# Altium project LPC55S69_Board.PrjPcb (part 1 of 2)
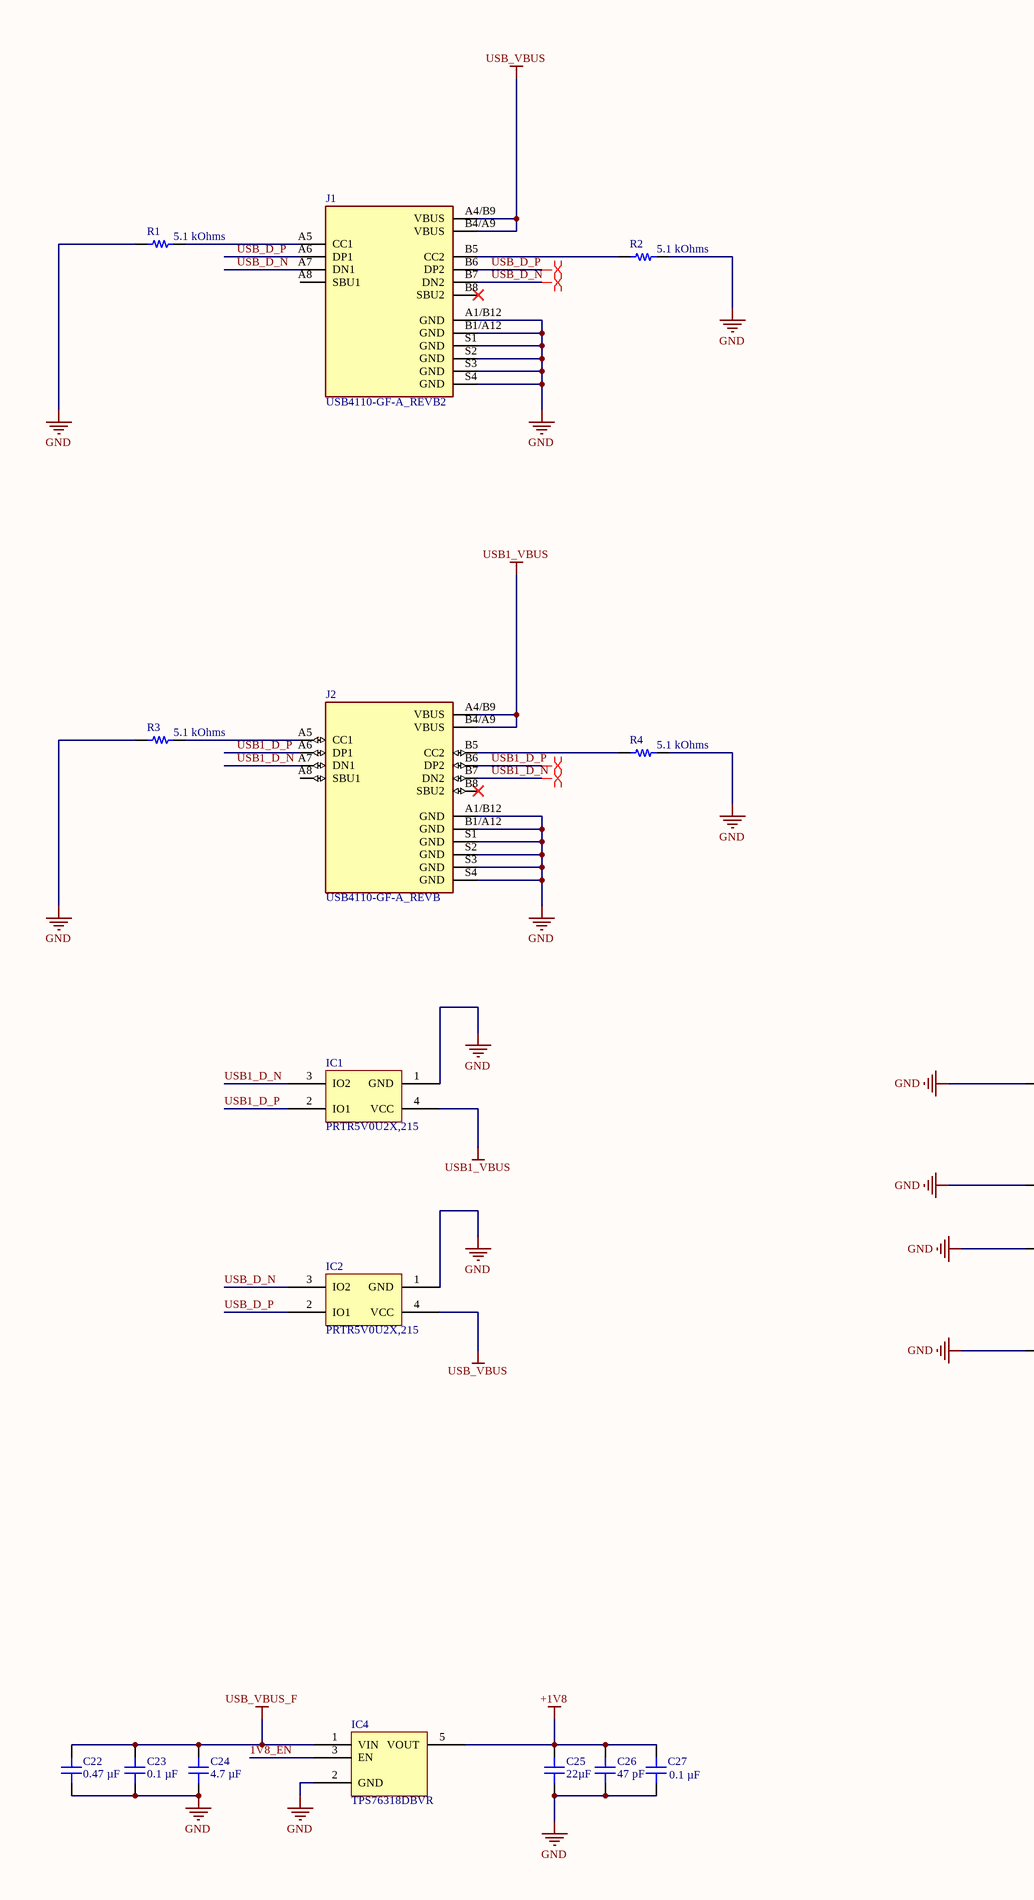
[diagram p0: Main.SchDoc, left]
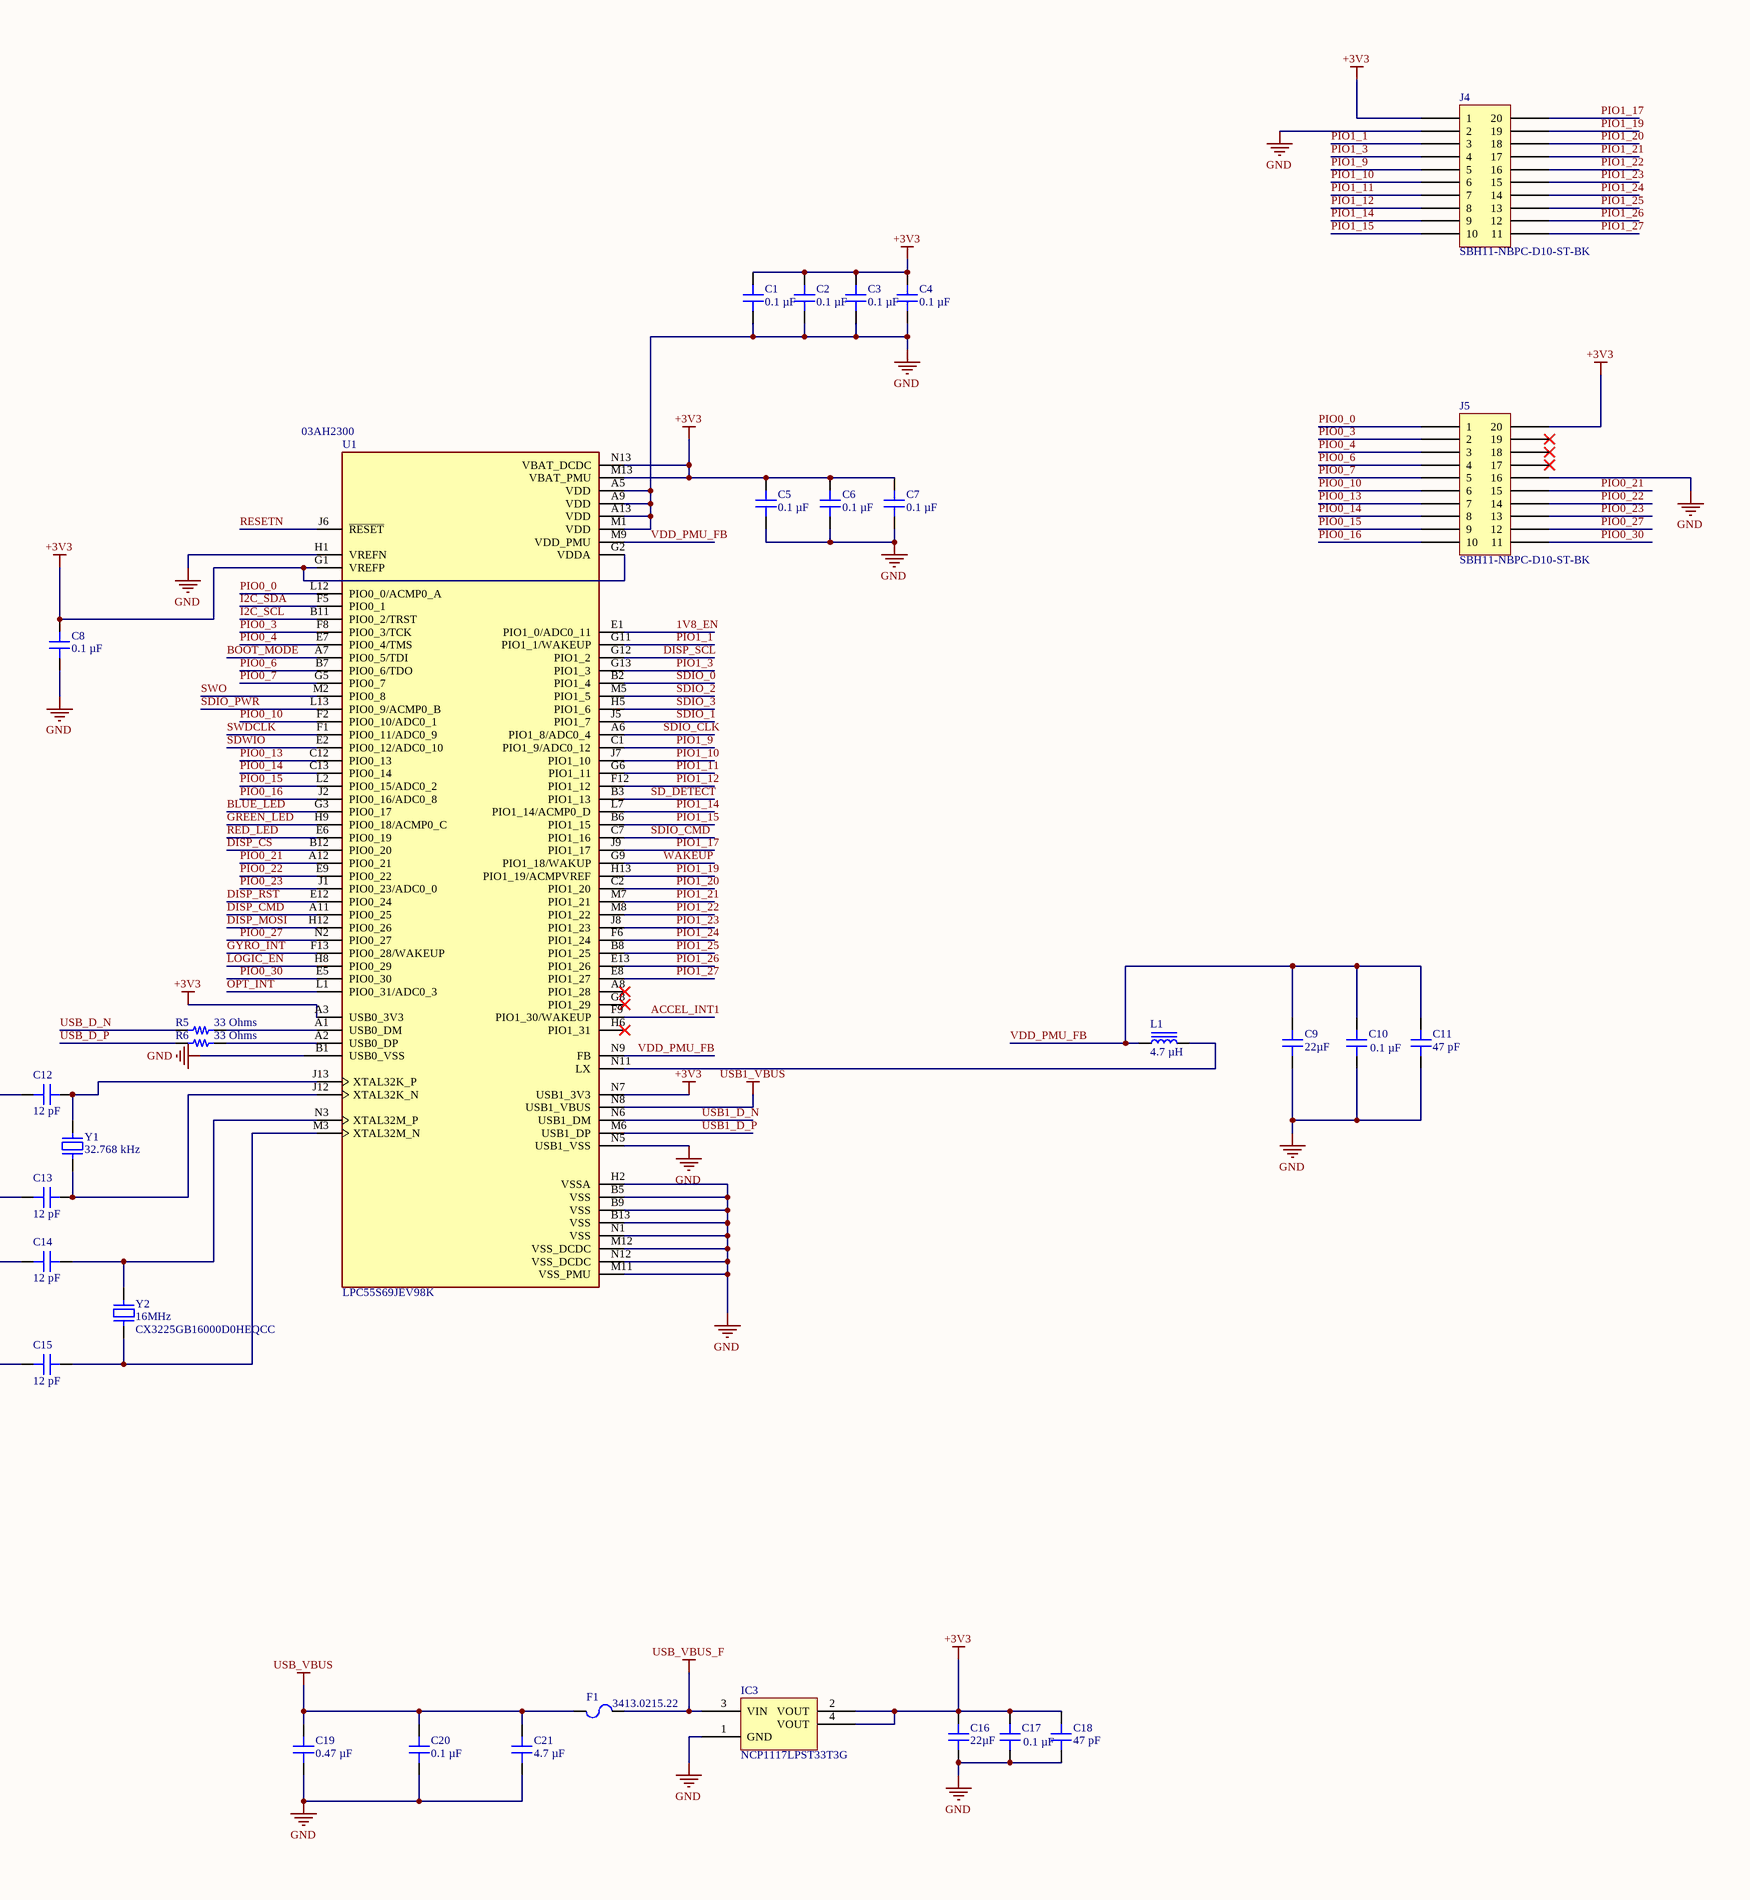
[diagram p1: Main.SchDoc, right]
3 sheets, 143 parts. Net scope: global (net labels, ports and power ports of the same name join across sheets).
Board file: LPC_DevBoard.PcbDoc
Sheets:
  Main.SchDoc
  Sensors.SchDoc
  microSD_Display.SchDoc

## Sheet Main.SchDoc
size A2; SheetNumber: 1; SheetTotal: 3

### Parts
C1  0.1 µF  [CAP 0603_1608]
C2  0.1 µF  [CAP 0603_1608]
C3  0.1 µF  [CAP 0603_1608]
C4  0.1 µF  [CAP 0603_1608]
C5  0.1 µF  [CAP 0603_1608]
C6  0.1 µF  [CAP 0603_1608]
C7  0.1 µF  [CAP 0603_1608]
C8  0.1 µF  [CAP 0603_1608]
C9  22µF  [CAP 0603_1608]
C10  0.1 µF  [CAP 0603_1608]
C11  47 pF  [CAP 0603_1608]
C12  12 pF  [CAP 0603_1608]
C13  12 pF  [CAP 0603_1608]
C14  12 pF  [CAP 0603_1608]
C15  12 pF  [CAP 0603_1608]
C16  22µF  [CAP 0603_1608]
C17  0.1 µF  [CAP 0603_1608]
C18  47 pF  [CAP 0603_1608]
C19  0.47 µF  [CAP 0603_1608]
C20  0.1 µF  [CAP 0603_1608]
C21  4.7 µF  [CAP 0603_1608]
C22  0.47 µF  [CAP 0603_1608]
C23  0.1 µF  [CAP 0603_1608]
C24  4.7 µF  [CAP 0603_1608]
C25  22µF  [CAP 0603_1608]
C26  47 pF  [CAP 0603_1608]
C27  0.1 µF  [CAP 0603_1608]
F1  3413.0215.22  [FUSE 1206_3216 0.6MM]
IC1  PRTR5V0U2X,215  [SOT143B]
IC2  PRTR5V0U2X,215  [SOT143B]
IC3  NCP1117LPST33T3G  [ON SEMI SOT-223 ST(318H)]
IC4  TPS76318DBVR  [TI SOT-23-5 DBV]
J1  USB4110-GF-A_REVB2  [USBNew]
J2  USB4110-GF-A_REVB  [GCT_USB4110-GF-A_REVB]
J4  SBH11-NBPC-D10-ST-BK  [SULLINS SBH11-NBPC-D10-ST-BK]
J5  SBH11-NBPC-D10-ST-BK  [SULLINS SBH11-NBPC-D10-ST-BK]
L1  4.7 µH  [TDK VLS252012CX]
R1  5.1 kOhms  [RES 0603_1608]
R2  5.1 kOhms  [RES 0603_1608]
R3  5.1 kOhms  [RES 0603_1608]
R4  5.1 kOhms  [RES 0603_1608]
R5  33 Ohms  [RES 0603_1608]
R6  33 Ohms  [RES 0603_1608]
U1  LPC55S69JEV98K  Supplier Part Number 1: 03AH2300  [IC_LPC55S69JEV98K]
Y1  32.768 kHz  [ABRACON ABS06]
Y2  16MHz  Part Number: CX3225GB16000D0HEQCC  [KYOCERA CX3225GB]

### Nets
+1V8: C25.1 C26.2 C27.2 IC4.5(VOUT)
+3V3: C1.2 C2.2 C3.2 C4.2 C5.2 C6.2 C7.2 C8.2 C16.1 C17.2 C18.2 IC3.2(VOUT) IC3.4(VOUT) J4.1 J5.20 U1.A3(USB0_3V3) U1.G1(VREFP) U1.G2(VDDA) U1.M13(VBAT_PMU) U1.N7(USB1_3V3) U1.N13(VBAT_DCDC)
GND: C1.1 C2.1 C3.1 C4.1 C5.1 C6.1 C7.1 C8.1 C9.2 C10.1 C11.1 C12.2 C13.2 C14.2 C15.2 C16.2 C17.1 C18.1 C19.1 C20.1 C21.1 C22.1 C23.1 C24.1 C25.2 C26.1 C27.1 IC1.1(GND) IC2.1(GND) IC3.1(GND) IC4.2(GND) J1.A1/B12(GND) J1.B1/A12(GND) J1.S1(GND) J1.S2(GND) J1.S3(GND) J1.S4(GND) J2.A1/B12(GND) J2.B1/A12(GND) J2.S1(GND) J2.S2(GND) J2.S3(GND) J2.S4(GND) J4.2 J5.16 R1.1 R2.2 R3.1 R4.2 U1.A5(VDD) U1.A9(VDD) U1.A13(VDD) U1.B1(USB0_VSS) U1.B5(VSS) U1.B9(VSS) U1.B13(VSS) U1.H1(VREFN) U1.H2(VSSA) U1.M1(VDD) U1.M11(VSS_PMU) U1.M12(VSS_DCDC) U1.N1(VSS) U1.N5(USB1_VSS) U1.N12(VSS_DCDC)
USB1_VBUS: IC1.4(VCC) J2.A4/B9(VBUS) J2.B4/A9(VBUS) U1.N8(USB1_VBUS)
USB_VBUS: C19.2 C20.2 C21.2 F1.1 IC2.4(VCC) J1.A4/B9(VBUS) J1.B4/A9(VBUS)
USB_VBUS_F: C22.2 C23.2 C24.2 F1.2 IC3.3(VIN) IC4.1(VIN)
1V8_EN: IC4.3(EN) U1.E1(PIO1_0/ADC0_11)
ACCEL_INT1: U1.F9(PIO1_30/WAKEUP)
BLUE_LED: U1.G3(PIO0_17)
BOOT_MODE: U1.A7(PIO0_5/TDI)
DISP_CMD: U1.A11(PIO0_25)
DISP_CS: U1.B12(PIO0_20)
DISP_MOSI: U1.H12(PIO0_26)
DISP_RST: U1.E12(PIO0_24)
DISP_SCL: U1.G12(PIO1_2)
GREEN_LED: U1.H9(PIO0_18/ACMP0_C)
GYRO_INT: U1.F13(PIO0_28/WAKEUP)
I2C_SCL: U1.B11(PIO0_2/TRST)
I2C_SDA: U1.F5(PIO0_1)
LOGIC_EN: U1.H8(PIO0_29)
OPT_INT: U1.L1(PIO0_31/ADC0_3)
PIO0_0: J5.1 U1.L12(PIO0_0/ACMP0_A)
PIO0_3: J5.2 U1.F8(PIO0_3/TCK)
PIO0_4: J5.3 U1.E7(PIO0_4/TMS)
PIO0_6: J5.4 U1.B7(PIO0_6/TDO)
PIO0_7: J5.5 U1.G5(PIO0_7)
PIO0_10: J5.6 U1.F2(PIO0_10/ADC0_1)
PIO0_13: J5.7 U1.C12(PIO0_13)
PIO0_14: J5.8 U1.C13(PIO0_14)
PIO0_15: J5.9 U1.L2(PIO0_15/ADC0_2)
PIO0_16: J5.10 U1.J2(PIO0_16/ADC0_8)
PIO0_21: J5.15 U1.A12(PIO0_21)
PIO0_22: J5.14 U1.E9(PIO0_22)
PIO0_23: J5.13 U1.J1(PIO0_23/ADC0_0)
PIO0_27: J5.12 U1.N2(PIO0_27)
PIO0_30: J5.11 U1.E5(PIO0_30)
PIO1_1: J4.3 U1.G11(PIO1_1/WAKEUP)
PIO1_3: J4.4 U1.G13(PIO1_3)
PIO1_9: J4.5 U1.C1(PIO1_9/ADC0_12)
PIO1_10: J4.6 U1.J7(PIO1_10)
PIO1_11: J4.7 U1.G6(PIO1_11)
PIO1_12: J4.8 U1.F12(PIO1_12)
PIO1_14: J4.9 U1.L7(PIO1_14/ACMP0_D)
PIO1_15: J4.10 U1.B6(PIO1_15)
PIO1_17: J4.20 U1.J9(PIO1_17)
PIO1_19: J4.19 U1.H13(PIO1_19/ACMPVREF)
PIO1_20: J4.18 U1.C2(PIO1_20)
PIO1_21: J4.17 U1.M7(PIO1_21)
PIO1_22: J4.16 U1.M8(PIO1_22)
PIO1_23: J4.15 U1.J8(PIO1_23)
PIO1_24: J4.14 U1.F6(PIO1_24)
PIO1_25: J4.13 U1.B8(PIO1_25)
PIO1_26: J4.12 U1.E13(PIO1_26)
PIO1_27: J4.11 U1.E8(PIO1_27)
RED_LED: U1.E6(PIO0_19)
RESETN: U1.J6(~{RESET})
SD_DETECT: U1.B3(PIO1_13)
SDIO_0: U1.B2(PIO1_4)
SDIO_1: U1.J5(PIO1_7)
SDIO_2: U1.M5(PIO1_5)
SDIO_3: U1.H5(PIO1_6)
SDIO_CLK: U1.A6(PIO1_8/ADC0_4)
SDIO_CMD: U1.C7(PIO1_16)
SDIO_PWR: U1.L13(PIO0_9/ACMP0_B)
SDWIO: U1.E2(PIO0_12/ADC0_10)
SWDCLK: U1.F1(PIO0_11/ADC0_9)
SWO: U1.M2(PIO0_8)
USB1_D_N: IC1.3(IO2) J2.A7(DN1) J2.B7(DN2) U1.N6(USB1_DM)
USB1_D_P: IC1.2(IO1) J2.A6(DP1) J2.B6(DP2) U1.M6(USB1_DP)
USB_D_N: IC2.3(IO2) J1.A7(DN1) J1.B7(DN2) R5.1
USB_D_P: IC2.2(IO1) J1.A6(DP1) J1.B6(DP2) R6.1
VDD_PMU_FB: C9.1 C10.2 C11.2 L1.1 U1.M9(VDD_PMU) U1.N9(FB)
WAKEUP: U1.G9(PIO1_18/WAKUP)
NetC12_1: C12.1 U1.J13(XTAL32K_P) Y1.2
NetC13_1: C13.1 U1.J12(XTAL32K_N) Y1.1
NetC14_1: C14.1 U1.N3(XTAL32M_P) Y2.1
NetC15_1: C15.1 U1.M3(XTAL32M_N) Y2.3
NetJ1_A5: J1.A5(CC1) R1.2
NetJ1_B5: J1.B5(CC2) R2.1
NetJ2_A5: J2.A5(CC1) R3.2
NetJ2_B5: J2.B5(CC2) R4.1
NetL1_2: L1.2 U1.N11(LX)
NetR5_2: R5.2 U1.A1(USB0_DM)
NetR6_2: R6.2 U1.A2(USB0_DP)

Not connected (* = marked no-connect by the designer): J1 A8(SBU1) B8(SBU2)*; J2 A8(SBU1) B8(SBU2)*; J5 17* 18* 19*; U1 A8(PIO1_28)* G8(PIO1_29)* H6(PIO1_31)*

### Layout directives
differential pair: USB1_D_N, USB1_D_P, USB_D_N, USB_D_P

### Library data of the parts
C1-C8 C10 C17 C20 C23 C27 = CS0603KRX7R7BB104: CAP CER 0.1UF 16V X7R 0603; manufacturer: Yageo; Tolerance: ±10%; Part Number: CS0603KRX7R7BB104; Value: 0.1 µF; Applications: Boardflex Sensitive; Capacitance: 0.1 µF; componentlink1description: Datasheet; componentlink1url: http://www.yageo.com/NewPortal/yageodocoutput?fileName=/pdf/MLCC/UPY-ST_NPOX7R_16V-to-3KV_5.pdf; componentlink2description: DigiKey Link; componentlink2url: https://www.digikey.com/en/products/detail/yageo/CS0603KRX7R7BB104/6097897; Device Package: 0603 (1608 Metric); Features: Soft Termination; lastupdated: 12.06.2022 00:52:33; Lifecycle Status: Active; Minimum Order: 1; Mounting Type: Surface Mount, MLCC; Operating Temperature: -55°C ~ 125°C; Package / Case: 0603 (1608 Metric); packaging: TapeAndReel; partid: 2286; Part Status: Active; price: 0.02; series: CS; Size / Dimension: 0.063" L x 0.031" W (1.60mm x 0.80mm); Supplier 1: DigiKey; Supplier Part Number 1: 311-3560-1-ND; Temperature Coefficient: X7R; Thickness (Max): 0.037" (0.95mm); Voltage - Rated: 16V
C9 C16 C25 = 06036D226MAT2A: CAP CER 22UF 6.3V X5R 0603; manufacturer: AVX Corporation; Tolerance: ±20%; Part Number: 06036D226MAT2A; Value: 22µF; Applications: General Purpose; Capacitance: 22µF; componentlink1description: Datasheet; componentlink1url: http://datasheets.avx.com/cx5r.pdf; componentlink2description: DigiKey Link; componentlink2url: http://digikey.com/product-detail/en/avx-corporation/06036D226MAT2A/478-10812-1-ND/7536349; Device Package: 0603 (1608 Metric); lastupdated: 2.09.2020 01:03:16; Lifecycle Status: Active; Minimum Order: 1; Mounting Type: Surface Mount, MLCC; Operating Temperature: -55°C ~ 85°C; Package / Case: 0603 (1608 Metric); packaging: TapeAndReel; partid: 13180; Part Status: Active; price: 0.10; series: -; Size / Dimension: 0.063" L x 0.032" W (1.60mm x 0.81mm); Supplier 1: DigiKey; Supplier Part Number 1: 478-10812-1-ND; Temperature Coefficient: X5R; Thickness (Max): 0.040" (1.02mm); Voltage - Rated: 6.3V
C11 C18 C26 = C0603C470J3GACAUTO: CAP CER 47PF 25V C0G/NP0 0603; manufacturer: KEMET; Temperature Coefficient: C0G, NP0; Tolerance: ±5%; Part Number: C0603C470J3GACAUTO; Value: 47 pF; Applications: Automotive; Capacitance: 47 pF; componentlink1description: Datasheet; componentlink1url: https://api.kemet.com/component-edge/download/datasheet/C0603C470J3GACAUTO.pdf; componentlink2description: DigiKey Link; componentlink2url: https://www.digikey.com/en/products/detail/kemet/C0603C470J3GACAUTO/3314884; Device Package: 0603 (1608 Metric); Features: Low ESL; lastupdated: 12.06.2022 00:51:55; Lifecycle Status: Active; Minimum Order: 1; Mounting Type: Surface Mount, MLCC; Operating Temperature: -55°C ~ 125°C; Package / Case: 0603 (1608 Metric); packaging: TapeAndReel; partid: 15056; Part Status: Active; price: 0.02; Ratings: AEC-Q200; series: SMD Auto C0G; Size / Dimension: 0.063" L x 0.031" W (1.60mm x 0.80mm); Supplier 1: DigiKey; Supplier Part Number 1: 399-6889-1-ND; Thickness (Max): 0.034" (0.87mm); Voltage - Rated: 25V
C12-C15 = CC0603GRNPO9BN120: CAP CER 12PF 50V C0G/NPO 0603; manufacturer: Yageo; Temperature Coefficient: C0G, NP0; Tolerance: ±2%; Part Number: CC0603GRNPO9BN120; Value: 12 pF; Applications: General Purpose; Capacitance: 12 pF; componentlink1description: Datasheet; componentlink1url: https://www.yageo.com/upload/media/product/productsearch/datasheet/mlcc/UPY-GP_NP0_16V-to-50V_17.pdf; componentlink2description: DigiKey Link; componentlink2url: https://www.digikey.com/en/products/detail/yageo/CC0603GRNPO9BN120/5883540; Device Package: 0603 (1608 Metric); lastupdated: 14.06.2022 20:58:18; Lifecycle Status: Active; Minimum Order: 1; Mounting Type: Surface Mount, MLCC; Operating Temperature: -55°C ~ 125°C; Package / Case: 0603 (1608 Metric); packaging: TapeAndReel; partid: 3692; Part Status: Active; price: 0.02; series: CC; Size / Dimension: 0.063" L x 0.031" W (1.60mm x 0.80mm); Supplier 1: DigiKey; Supplier Part Number 1: 311-3917-1-ND; Thickness (Max): 0.035" (0.90mm); Voltage - Rated: 50V
C19 C22 = CC0603KRX5R6BB474: CAP CER 0.47UF 10V X5R 0603; manufacturer: Yageo; Tolerance: ±10%; Part Number: CC0603KRX5R6BB474; Value: 0.47 µF; Applications: General Purpose; Capacitance: 0.47 µF; componentlink1description: Datasheet; componentlink1url: https://www.yageo.com/upload/media/product/productsearch/datasheet/mlcc/UPY-GPHC_X5R_4V-to-50V_25.pdf; componentlink2description: DigiKey Link; componentlink2url: https://www.digikey.com/en/products/detail/yageo/CC0603KRX5R6BB474/2345079; Device Package: 0603 (1608 Metric); lastupdated: 12.06.2022 00:52:33; Lifecycle Status: Active; Minimum Order: 1; Mounting Type: Surface Mount, MLCC; Operating Temperature: -55°C ~ 85°C; Package / Case: 0603 (1608 Metric); packaging: TapeAndReel; partid: 2283; Part Status: Active; price: 0.02; series: CC; Size / Dimension: 0.063" L x 0.031" W (1.60mm x 0.80mm); Supplier 1: DigiKey; Supplier Part Number 1: 311-1783-1-ND; Temperature Coefficient: X5R; Thickness (Max): 0.035" (0.90mm); Voltage - Rated: 10V
C21 C24 = GRM188C71A475KE11D: CAP CER 4.7UF 10V X7S 0603; manufacturer: Murata Electronics; Tolerance: ±10%; Part Number: GRM188C71A475KE11D; Value: 4.7 µF; Applications: General Purpose; Capacitance: 4.7 µF; componentlink1description: Datasheet; componentlink1url: https://search.murata.co.jp/Ceramy/image/img/A01X/G101/ENG/GRM188C71A475KE11-01.pdf; componentlink2description: DigiKey Link; componentlink2url: https://www.digikey.com/en/products/detail/murata-electronics/GRM188C71A475KE11D/4905309; Device Package: 0603 (1608 Metric); lastupdated: 12.06.2022 00:52:33; Lifecycle Status: Active; Minimum Order: 1; Mounting Type: Surface Mount, MLCC; Operating Temperature: -55°C ~ 125°C; Package / Case: 0603 (1608 Metric); packaging: TapeAndReel; partid: 2397; Part Status: Active; price: 0.05; series: GRM; Size / Dimension: 0.063" L x 0.031" W (1.60mm x 0.80mm); Supplier 1: DigiKey; Supplier Part Number 1: 490-11992-1-ND; Temperature Coefficient: X7S; Thickness (Max): 0.037" (0.95mm); Voltage - Rated: 10V
F1 = 3413.0215.22: FUSE BOARD MNT 800MA 32VAC 63VDC; Manufacturer: Schurter Inc.; Approval Agency: cURus, VDE; Breaking Capacity @ Rated Voltage: 63A; Fuse Type: Board Mount (Cartridge Style Excluded); Melting I²t: 0.18; Response Time: Fast Blow; Voltage Rating - AC: 32V; Voltage Rating - DC: 63V; Part Number: 3413.0215.22; Approvals: cURus, VDE; ComponentLink1Description: Datasheet; ComponentLink1URL: https://us.schurter.com/pdf/english/typ_USI_1206.pdf; ComponentLink2Description: DigiKey Link; ComponentLink2URL: http://digikey.com/product-detail/en/schurter-inc/3413.0215.22/486-1143-1-ND/1522975; Current Rating (Amps): 800mA; Device Package: 1206 (3216 Metric); LastUpdated: 2.09.2020 01:30:41; Lifecycle Status: Active; Minimum Order: 1; Mounting Type: Surface Mount; Operating Temperature: -55°C ~ 90°C; Package / Case: 1206 (3216 Metric); Packaging: TapeAndReel; Part Status: Active; Price: 0.26; Series: USI 1206; Size / Dimension: 0.126" L x 0.063" W x 0.024" H (3.20mm x 1.60mm x 0.60mm); Supplier 1: DigiKey; Supplier Part Number 1: 486-1143-1-ND
IC1 IC2 = PRTR5V0U2X,215: TVS DIODE 5.5V SOT143B; Manufacturer: Nexperia USA Inc.; Capacitance @ Frequency: 1pF @ 1MHz; Power Line Protection: Yes; Unidirectional Channels: 2; Voltage - Breakdown (Min): 6V; Voltage - Reverse Standoff (Typ): 5.5V (Max); Part Number: PRTR5V0U2X,215; Applications: General Purpose; ComponentLink1Description: Datasheet; ComponentLink1URL: https://assets.nexperia.com/documents/data-sheet/PRTR5V0U2X.pdf; ComponentLink2Description: DigiKey Link; ComponentLink2URL: //digikey.com/product-detail/en/nexperia-usa-inc/PRTR5V0U2X215/1727-3884-2-ND/1163690; Device Package: TO-253-4, TO-253AA; LastUpdated: 9.12.2019 21:29:05; Lifecycle Status: 0; Minimum Order: 1; Mounting Type: Surface Mount; Operating Temperature: -40°C ~ 85°C (TA); Package / Case: TO-253-4, TO-253AA; Packaging: TapeAndReel; PartId: 5451; Part Status: Active; Price: 0.18; Series: -; Supplier 1: DigiKey; Supplier Part Number 1: 1727-3884-2-ND; Supplier Device Package: SOT-143B; Type: Steering (Rail to Rail)
IC3 = NCP1117LPST33T3G: IC REG LINEAR 3.3V 1A SOT223; Manufacturer: ON Semiconductor; Current - Quiescent (Iq): 700µA; Number of Regulators: 1; Output Configuration: Positive; Output Type: Fixed; Protection Features: Over Current, Over Temperature; PSRR: 60dB (120Hz); Voltage Dropout (Max): 1.4V @ 1A; Voltage - Input (Max): 18V; Part Number: NCP1117LPST33T3G; ComponentLink1Description: Datasheet; ComponentLink1URL: http://www.onsemi.com/pub/Collateral/NCP1117LP-D.PDF; ComponentLink2Description: DigiKey Link; ComponentLink2URL: http://digikey.com/product-detail/en/on-semiconductor/NCP1117LPST33T3G/NCP1117LPST33T3GOSCT-ND/3462387; Current - Output: 1A; LastUpdated: 12.06.2022 01:44:12; Lifecycle Status: Active; Minimum Order: 1; Mounting Type: Surface Mount; Package / Case: TO-261-4, TO-261AA; Packaging: TapeAndReel; Part Status: Active; Price: 0.12; Series: -; Supplier 1: DigiKey; Supplier Part Number 1: NCP1117LPST33T3GOSCT-ND; Supplier Device Package: SOT-223; Voltage - Output (Min/Fixed): 3.3V
IC4 = TPS76318DBVR: IC REG LINEAR 1.8V 150MA SOT23-5; Manufacturer: Texas Instruments; Control Features: Enable; Current - Quiescent (Iq): 100 µA; Current - Supply (Max): 140 µA; Number of Regulators: 1; Output Configuration: Positive; Output Type: Fixed; Protection Features: Over Current, Over Temperature, Reverse Polarity; PSRR: 60dB (1kHz); Voltage - Input (Max): 10V; Part Number: TPS76318DBVR; ComponentLink1Description: Datasheet; ComponentLink1URL: http://www.ti.com/general/docs/suppproductinfo.tsp?distId=10&gotoUrl=http%3A%2F%2Fwww.ti.com%2Flit%2Fgpn%2Ftps763; ComponentLink2Description: DigiKey Link; ComponentLink2URL: https://www.digikey.com/en/products/detail/texas-instruments/TPS76318DBVR/382161; Current - Output: 150mA; LastUpdated: 16.06.2022 11:30:59; Lifecycle Status: Active; Minimum Order: 1; Mounting Type: Surface Mount; Operating Temperature: -40°C ~ 125°C; Package / Case: SC-74A, SOT-753; Packaging: TapeAndReel; Part Status: Active; Price: 0.43; Series: -; Supplier 1: DigiKey; Supplier Part Number 1: 296-11016-1-ND; Supplier Device Package: SOT-23-5; Voltage - Output (Min/Fixed): 1.8V
J1 J2 = USB4110-GF-A_REVB: USB; Value: *; Availability: Unavailable; Price: None; Package: None; MP: USB4110-GF-A_REVB
  J2: ComponentLink1Description: New link; ComponentLink1URL: *
J4 J5 = SBH11-NBPC-D10-ST-BK: CONN HEADER VERT 20POS 2.54MM; Manufacturer: Sullins Connector Solutions; Current Rating (Amps): 3A; Material Flammability Rating: UL94 V-0; Number of Positions: 20; Number of Positions Loaded: All; Shrouding: Shrouded - 4 Wall; Style: Board to Board or Cable; Part Number: SBH11-NBPC-D10-ST-BK; ComponentLink1Description: Datasheet; ComponentLink1URL: https://s3.amazonaws.com/catalogspreads-pdf/PAGE122%20.100%20SBH11%20SERIES%20MALE%20BOX%20HDR%20ST%20RA%20SMT.pdf; ComponentLink2Description: DigiKey Link; ComponentLink2URL: http://digikey.com/product-detail/en/sullins-connector-solutions/SBH11-NBPC-D10-ST-BK/SBH11-NBPC-D10-ST-BK-ND/4558585; Connector Type: Header; Contact Finish - Mating: Gold; Contact Finish - Post: Gold; Contact Finish Thickness - Mating: Flash; Contact Material: Brass; Contact Shape: Square; Contact Type: Male Pin; Fastening Type: Push-Pull; Features: Keying Slot; Insulation Color: Black; Insulation Material: Polyamide (PA), Nylon; LastUpdated: 21.06.2022 14:45:11; Lifecycle Status: Active; Minimum Order: 1000; Mounting Type: Through Hole; Number of Rows: 2; Operating Temperature: -40°C ~ 105°C; Packaging: Tray; PartId: 135; Part Status: Active; Price: 0.40; Series: SBH11; Supplier 1: DigiKey; Supplier Part Number 1: SBH11-NBPC-D10-ST-BK-ND; Termination: Solder
L1 = VLS252012CX-4R7M-1: FIXED IND 4.7UH 1.24A 210MOHM SM; Manufacturer: TDK Corporation; Current - Saturation: 1.1A; DC Resistance (DCR): 210mOhm Max; Inductance Frequency - Test: 1 MHz; Material - Core: Ferrite; Shielding: Shielded; Tolerance: ±20%; Type: Wirewound; Part Number: VLS252012CX-4R7M-1; ComponentLink1Description: Datasheet; ComponentLink1URL: https://product.tdk.com/info/en/catalog/datasheets/inductor_commercial_power_vls252012cx-1_en.pdf?ref_disty=digikey; ComponentLink2Description: DigiKey Link; ComponentLink2URL: https://www.digikey.com/en/products/detail/tdk-corporation/VLS252012CX-4R7M-1/5169790; Current Rating (Amps): 1.24 A; Device Package: Nonstandard; Height - Seated (Max): 0.047" (1.20mm); Inductance: 4.7 µH; LastUpdated: 12.06.2022 01:37:54; Lifecycle Status: Active; Minimum Order: 1; Mounting Type: Surface Mount; Operating Temperature: -40°C ~ 105°C; Package / Case: Nonstandard; Packaging: TapeAndReel; PartId: 228; Part Status: Active; Price: 0.16; Series: VLS-CX-1; Size / Dimension: 0.098" L x 0.079" W (2.50mm x 2.00mm); Supplier 1: DigiKey; Supplier Part Number 1: 445-172985-1-ND; Supplier Device Package: 2520; Value: 4.7 µH
R1-R4 = AC0603JR-075K1L: RES SMD 5.1K OHM 5% 1/10W 0603; Manufacturer: Yageo; Power (Watts): 0.1W, 1/10W; Temperature Coefficient: ±100ppm/°C; Part Number: AC0603JR-075K1L; Value: 5.1 kOhms; ComponentLink1Description: Datasheet; ComponentLink1URL: https://www.yageo.com/upload/media/product/productsearch/datasheet/rchip/PYu-AC_51_RoHS_L_7.pdf; ComponentLink2Description: DigiKey Link; ComponentLink2URL: https://www.digikey.com/en/products/detail/yageo/AC0603JR-075K1L/5896480; Composition: Thick Film; Device Package: 0603 (1608 Metric); Features: Automotive AEC-Q200, Moisture Resistant; Height - Seated (Max): 0.022" (0.55mm); LastUpdated: 12.06.2022 01:11:56; Lifecycle Status: Active; Minimum Order: 1; Number of Terminations: 2; Operating Temperature: -55°C ~ 155°C; Package / Case: 0603 (1608 Metric); Packaging: CutTape; PartId: 8336; Part Status: Active; Price: 0.01; Ratings: AEC-Q200; Resistance: 5.1 kOhms; Series: AC; Size / Dimension: 0.063" L x 0.031" W (1.60mm x 0.80mm); Supplier 1: DigiKey; Supplier Part Number 1: YAG3682CT-ND; Supplier Device Package: 0603; Tolerance: ±5%
R5 R6 = AC0603FR-0733RL: RES SMD 33 OHM 1% 1/10W 0603; Manufacturer: Yageo; Power (Watts): 0.1W, 1/10W; Temperature Coefficient: ±100ppm/°C; Part Number: AC0603FR-0733RL; Value: 33 Ohms; ComponentLink1Description: Datasheet; ComponentLink1URL: https://www.yageo.com/upload/media/product/productsearch/datasheet/rchip/PYu-AC_51_RoHS_L_7.pdf; ComponentLink2Description: DigiKey Link; ComponentLink2URL: https://www.digikey.com/en/products/detail/yageo/AC0603FR-0733RL/5896043; Composition: Thick Film; Device Package: 0603 (1608 Metric); Features: Automotive AEC-Q200, Moisture Resistant; Height - Seated (Max): 0.022" (0.55mm); LastUpdated: 18.06.2022 06:13:30; Lifecycle Status: Active; Minimum Order: 1; Number of Terminations: 2; Operating Temperature: -55°C ~ 155°C; Package / Case: 0603 (1608 Metric); Packaging: CutTape; PartId: 17381; Part Status: Active; Price: 0.01; Ratings: AEC-Q200; Resistance: 33 Ohms; Series: AC; Size / Dimension: 0.063" L x 0.031" W (1.60mm x 0.80mm); Supplier 1: DigiKey; Supplier Part Number 1: YAG3599CT-ND; Supplier Device Package: 0603; Tolerance: ±1%
U1 = LPC55S69JEV98K: MCU 32-bit ARM Cortex M33 RISC 640KB Flash 3.3V 98-Pin VFBGA Tray; MF: NXP Semiconductors; Availability: In Stock; Purchase-URL: https://pricing.snapeda.com/search/part/LPC55S69JEV98K/?ref=eda; SnapEDA_Link: https://www.snapeda.com/parts/LPC55S69JEV98K/Nexperia/view-part/?ref=snap; Price: None; Check_prices: https://www.snapeda.com/parts/LPC55S69JEV98K/Nexperia/view-part/?ref=eda; Package: None; MP: LPC55S69JEV98K; Value: *; Supplier 1: Newark
Y1 = ABS06-32.768KHZ-1-T: CRYSTAL 32.7680KHZ 12.5PF SMD; Manufacturer: Abracon LLC; ESR (Equivalent Series Resistance): 90 kOhms; Frequency Tolerance: ±10ppm; Operating Mode: Fundamental; Part Number: ABS06-32.768KHZ-1-T; ComponentLink1Description: Datasheet; ComponentLink1URL: https://abracon.com/Resonators/ABS06.pdf; ComponentLink2Description: DigiKey Link; ComponentLink2URL: https://www.digikey.com/en/products/detail/abracon-llc/ABS06-32-768KHZ-1-T/2217994; Frequency: 32.768 kHz; Height - Seated (Max): 0.024" (0.60mm); LastUpdated: 29.06.2022 14:39:54; Lifecycle Status: Active; Load Capacitance: 12.5pF; Minimum Order: 1; Mounting Type: Surface Mount; Operating Temperature: -40°C ~ 85°C; Package / Case: 2-SMD, No Lead; Packaging: TapeAndReel; PartId: 370; Part Status: Active; Price: 0.94; Series: ABS06; Size / Dimension: 0.079" L x 0.047" W (2.00mm x 1.20mm); Supplier 1: DigiKey; Supplier Part Number 1: 535-10248-1-ND; Type: kHz Crystal (Tuning Fork); Value: 32.768 kHz
Y2 = CX3225GB16000D0HEQCC: CRYSTAL 16.0000MHZ 8PF SMD; Manufacturer: Kyocera International Inc. Electronic Components; ESR (Equivalent Series Resistance): 80 Ohms; Frequency Stability: ±30ppm; Frequency Tolerance: ±20ppm; Operating Mode: Fundamental; ComponentLink1Description: Datasheet; ComponentLink1URL: //media.digikey.com/pdf/Data%20Sheets/AVX%20PDFs/CX3225GBxD0HEQ_Series_Spec.pdf; ComponentLink2Description: DigiKey Link; ComponentLink2URL: http://digikey.com/product-detail/en/kyocera-international-inc-electronic-components/CX3225GB16000D0HEQCC/1253-1180-1-ND/4453986; Frequency: 16MHz; Height - Seated (Max): 0.035" (0.90mm); LastUpdated: 14.06.2022 21:42:53; Lifecycle Status: Active; Load Capacitance: 8pF; Minimum Order: 1; Mounting Type: Surface Mount; Operating Temperature: -10°C ~ 70°C; Package / Case: 4-SMD, No Lead; Packaging: TapeAndReel; PartId: 485; Part Status: Active; Price: 0.33; Series: CX3225GB, Kyocera; Size / Dimension: 0.126" L x 0.098" W (3.20mm x 2.50mm); Supplier 1: DigiKey; Supplier Part Number 1: 1253-1180-1-ND; Type: MHz Crystal; Value: 16MHz

## Sheet Sensors.SchDoc
size A2; SheetNumber: 2; SheetTotal: 3
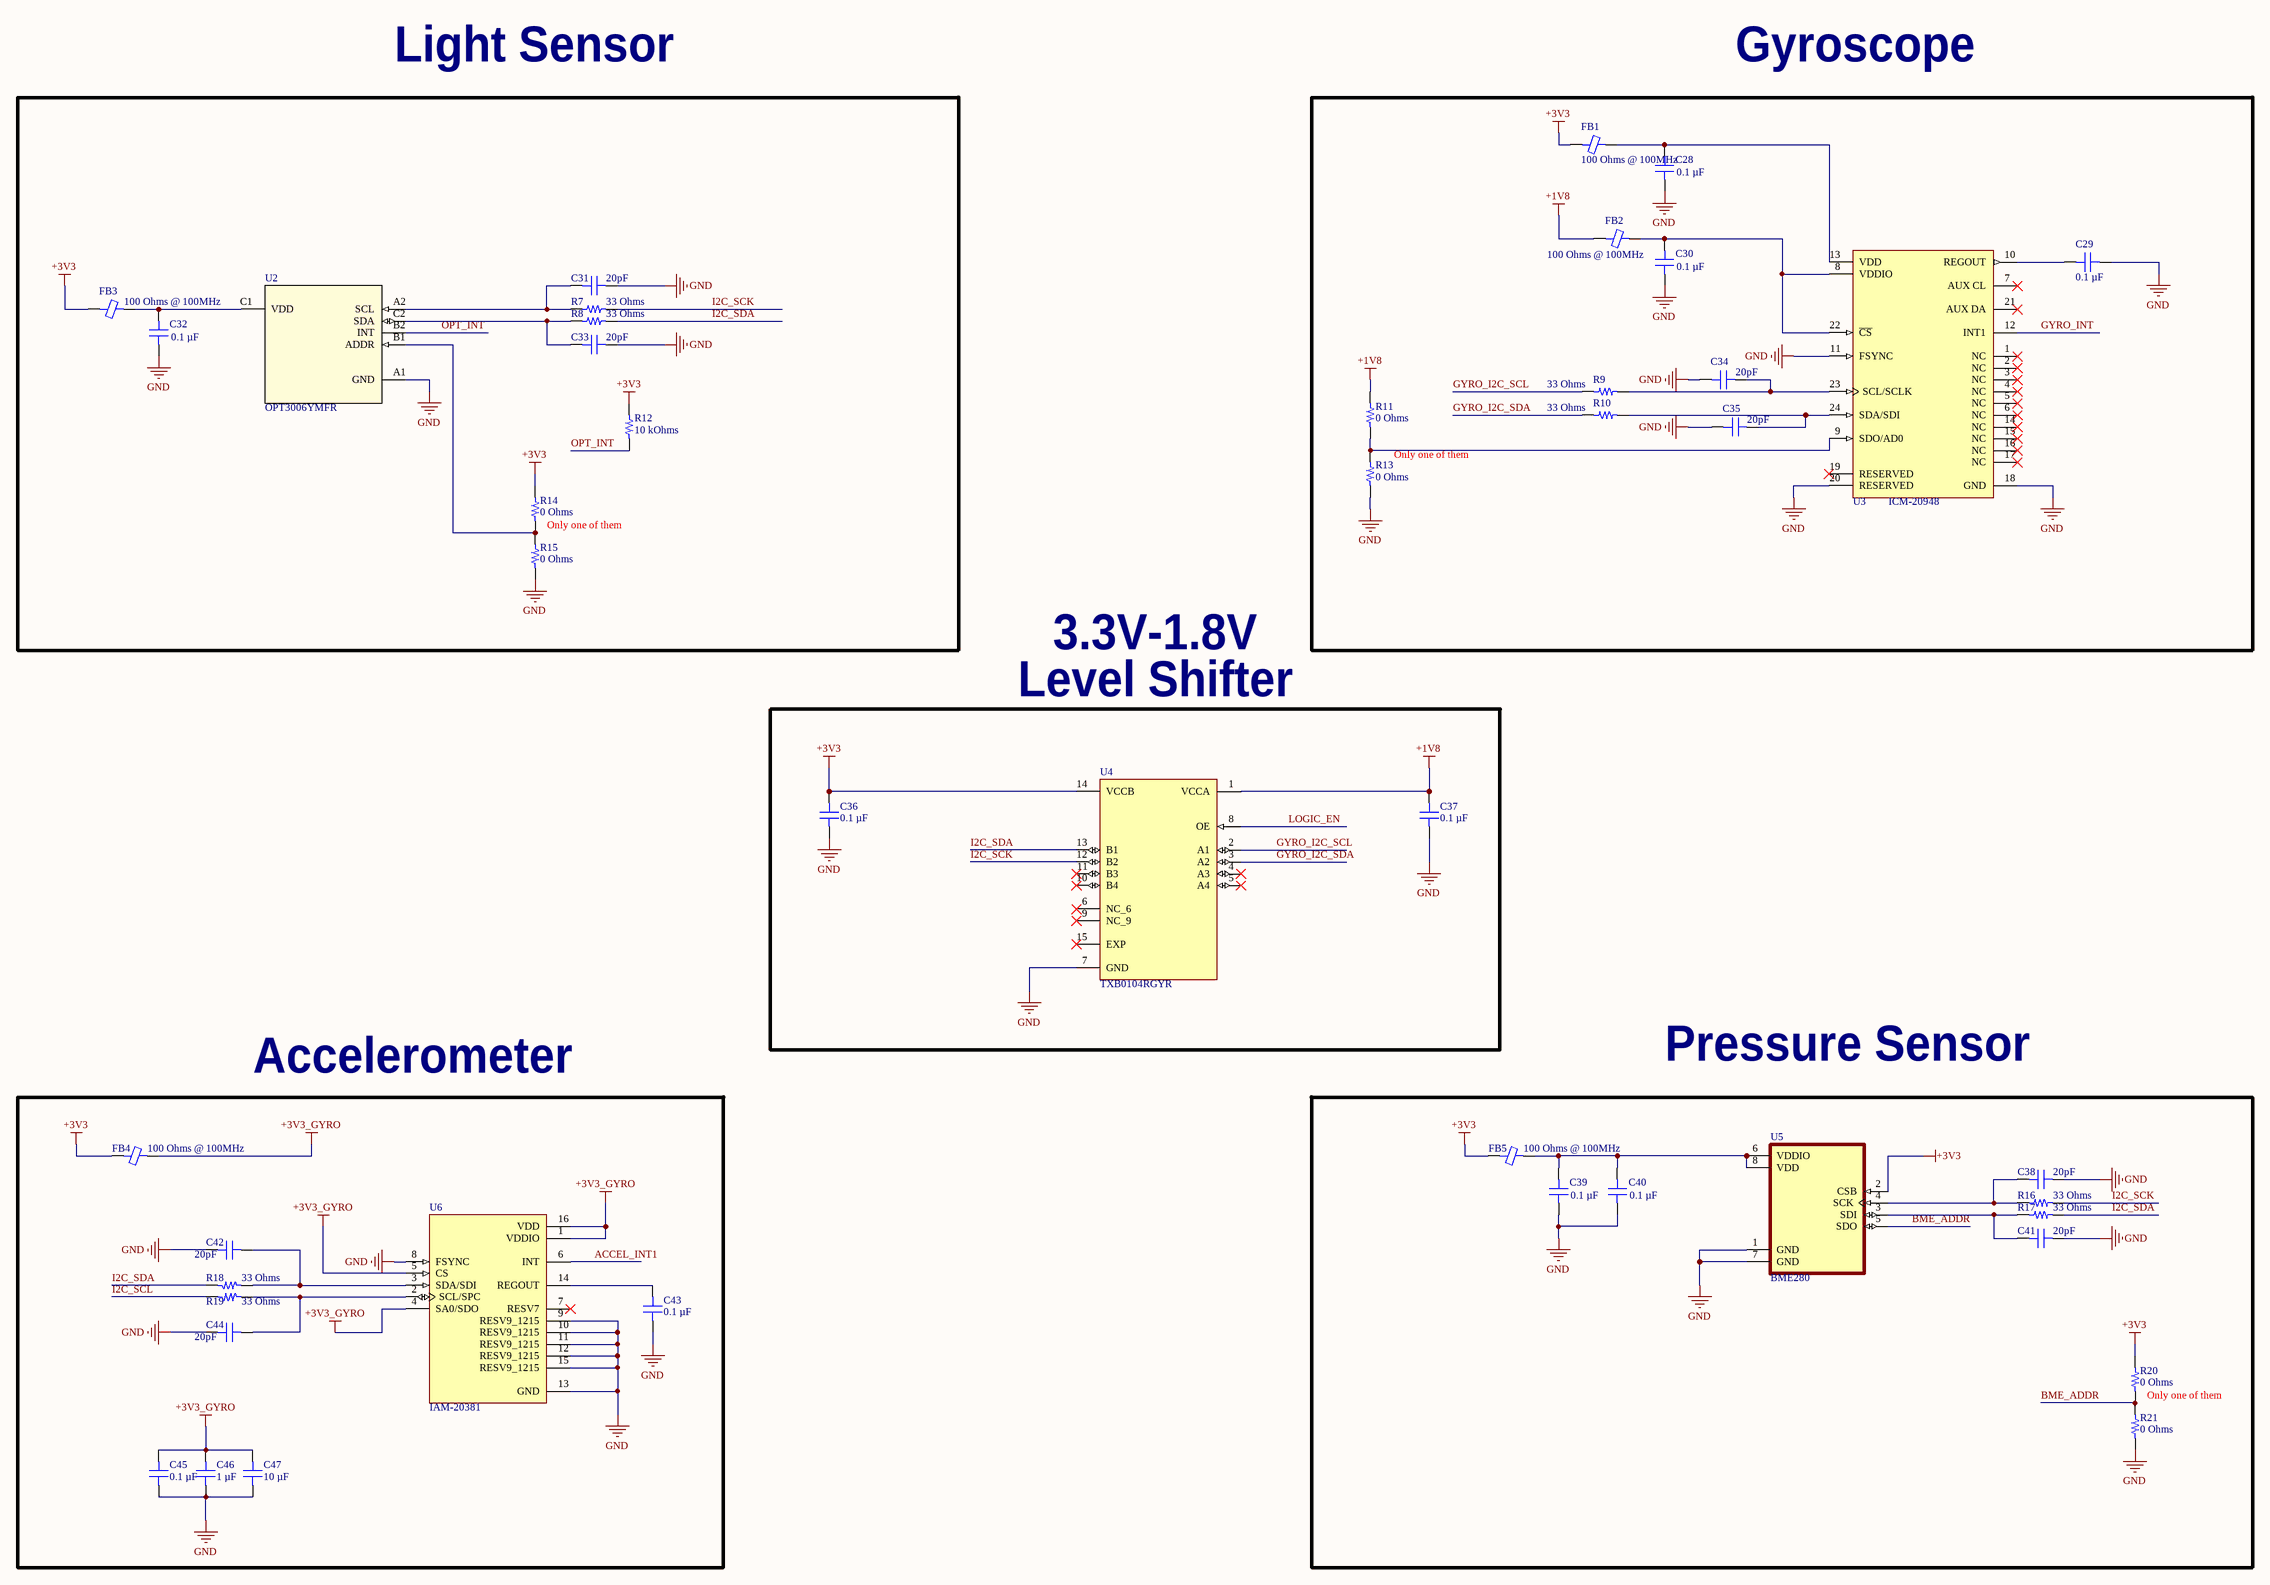
[diagram p2: Sensors.SchDoc]

### Parts
C28  0.1 µF  [CAP 0603_1608]
C29  0.1 µF  [CAP 0603_1608]
C30  0.1 µF  [CAP 0603_1608]
C31  20pF  [CAP 0603_1608]
C32  0.1 µF  [CAP 0603_1608]
C33  20pF  [CAP 0603_1608]
C34  20pF  [CAP 0603_1608]
C35  20pF  [CAP 0603_1608]
C36  0.1 µF  [CAP 0603_1608]
C37  0.1 µF  [CAP 0603_1608]
C38  20pF  [CAP 0603_1608]
C39  0.1 µF  [CAP 0603_1608]
C40  0.1 µF  [CAP 0603_1608]
C41  20pF  [CAP 0603_1608]
C42  20pF  [CAP 0603_1608]
C43  0.1 µF  [CAP 0603_1608]
C44  20pF  [CAP 0603_1608]
C45  0.1 µF  [CAP 0603_1608]
C46  1 µF  [CAP 0603_1608]
C47  10 µF  [CAP 0603_1608]
FB1  100 Ohms @ 100MHz  [FER 0402_1005]
FB2  100 Ohms @ 100MHz  [FER 0402_1005]
FB3  100 Ohms @ 100MHz  [FER 0402_1005]
FB4  100 Ohms @ 100MHz  [FER 0402_1005]
FB5  100 Ohms @ 100MHz  [FER 0402_1005]
R7  33 Ohms  [RES 0603_1608]
R8  33 Ohms  [RES 0603_1608]
R9  33 Ohms  [RES 0603_1608]
R10  33 Ohms  [RES 0603_1608]
R11  0 Ohms  [RES 0603_1608]
R12  10 kOhms  [RES 0603_1608]
R13  0 Ohms  [RES 0603_1608]
R14  0 Ohms  [RES 0603_1608]
R15  0 Ohms  [RES 0603_1608]
R16  33 Ohms  [RES 0603_1608]
R17  33 Ohms  [RES 0603_1608]
R18  33 Ohms  [RES 0603_1608]
R19  33 Ohms  [RES 0603_1608]
R20  0 Ohms  [RES 0603_1608]
R21  0 Ohms  [RES 0603_1608]
U2  OPT3006YMFR  [YMF0006A]
U3  ICM-20948  [TDK_InvenSense_0_IPC_C]
U4  TXB0104RGYR  [QFN50P350X350X100-15N]
U5  BME280  [PSON65P250X250X100-8N]
U6  IAM-20381  [PQFN50P300X300X80-16N]

### Blocks framed on the sheet
Only one of them: C31-C33 FB3 R7 R8 R12 R14 R15 U2
Only one of them: C28-C30 C34 C35 FB1 FB2 R9-R11 R13 U3
Level Shifter: C36 C37 U4
Accelerometer: C42-C47 FB4 R18 R19 U6
Only one of them: C38-C41 FB5 R16 R17 R20 R21 U5

### Nets
+1V8: C37.2 FB2.1 R11.2 U4.1(VCCA)
+3V3: C36.2 FB1.1 FB3.1 FB4.1 FB5.1 R12.1 R14.2 R20.2 U4.14(VCCB) U5.2(CSB)
+3V3_GYRO: C45.2 C46.2 C47.2 FB4.2 U6.1(VDDIO) U6.4(SA0/SDO) U6.5(CS) U6.16(VDD)
GND: C28.1 C29.1 C30.1 C31.2 C32.1 C33.2 C34.1 C35.1 C36.1 C37.1 C38.2 C39.1 C40.1 C41.2 C42.2 C43.1 C44.2 C45.1 C46.1 C47.1 R13.1 R15.1 R21.1 U2.A1(GND) U3.11(FSYNC) U3.18(GND) U3.20(RESERVED) U4.7(GND) U5.1(GND) U5.7(GND) U6.8(FSYNC) U6.9(RESV9_1215) U6.10(RESV9_1215) U6.11(RESV9_1215) U6.12(RESV9_1215) U6.13(GND) U6.15(RESV9_1215)
ACCEL_INT1: U6.6(INT)
BME_ADDR: R20.1 R21.2 U5.5(SDO)
GYRO_I2C_SCL: R9.1 U4.2(A1)
GYRO_I2C_SDA: R10.1 U4.3(A2)
GYRO_INT: U3.12(INT1)
I2C_SCK: R7.2 R16.2 U4.12(B2)
I2C_SCL: R19.2
I2C_SDA: R8.2 R17.2 R18.2 U4.13(B1)
LOGIC_EN: U4.8(OE)
OPT_INT: R12.2 U2.B2(INT)
NetC28_2: C28.2 FB1.2 U3.13(VDD)
NetC29_2: C29.2 U3.10(REGOUT)
NetC30_2: C30.2 FB2.2 U3.8(VDDIO) U3.22(~{CS})
NetC31_1: C31.1 R7.1 U2.A2(SCL)
NetC32_2: C32.2 FB3.2 U2.C1(VDD)
NetC33_1: C33.1 R8.1 U2.C2(SDA)
NetC34_2: C34.2 R9.2 U3.23(SCL/SCLK)
NetC35_2: C35.2 R10.2 U3.24(SDA/SDI)
NetC38_1: C38.1 R16.1 U5.4(SCK)
NetC39_2: C39.2 C40.2 FB5.2 U5.6(VDDIO) U5.8(VDD)
NetC41_1: C41.1 R17.1 U5.3(SDI)
NetC42_1: C42.1 R18.1 U6.3(SDA/SDI)
NetC43_2: C43.2 U6.14(REGOUT)
NetC44_1: C44.1 R19.1 U6.2(SCL/SPC)
NetR11_1: R11.1 R13.2 U3.9(SDO/AD0)
NetR14_1: R14.1 R15.2 U2.B1(ADDR)

Not connected (* = marked no-connect by the designer): U3 1(NC)* 2(NC)* 3(NC)* 4(NC)* 5(NC)* 6(NC)* 7(AUX_CL)* 14(NC)* 15(NC)* 16(NC)* 17(NC)* 19(RESERVED)* 21(AUX_DA)*; U4 4(A3)* 5(A4)* 6(NC_6)* 9(NC_9)* 10(B4)* 11(B3)* 15(EXP)*; U6 7(RESV7)*

### Notes on the sheet
- Light Sensor
- Gyroscope
- 3.3V-1.8V
- Pressure Sensor

### Library data of the parts
C28-C30 C32 C39 C40 = CS0603KRX7R7BB104: as C1 on sheet Main; Part Number: CS0603KRX7R7BB104; Value: 0.1 µF; Applications: Boardflex Sensitive; Capacitance: 0.1 µF; componentlink1description: Datasheet; componentlink1url: http://www.yageo.com/NewPortal/yageodocoutput?fileName=/pdf/MLCC/UPY-ST_NPOX7R_16V-to-3KV_5.pdf; componentlink2description: DigiKey Link; componentlink2url: https://www.digikey.com/en/products/detail/yageo/CS0603KRX7R7BB104/6097897; Device Package: 0603 (1608 Metric); Features: Soft Termination; lastupdated: 12.06.2022 00:52:33; Lifecycle Status: Active; Minimum Order: 1; Mounting Type: Surface Mount, MLCC; Operating Temperature: -55°C ~ 125°C; Package / Case: 0603 (1608 Metric); packaging: TapeAndReel; partid: 2286; Part Status: Active; price: 0.02; series: CS; Size / Dimension: 0.063" L x 0.031" W (1.60mm x 0.80mm); Supplier 1: DigiKey; Supplier Part Number 1: 311-3560-1-ND; Temperature Coefficient: X7R; Thickness (Max): 0.037" (0.95mm); Voltage - Rated: 16V
C31 C33-C35 C38 C41 C42 C44 = 06033A200JAT2A: CAP CER 20PF 25V C0G/NP0 0603; manufacturer: AVX Corporation; Temperature Coefficient: C0G, NP0; Tolerance: ±5%; Part Number: 06033A200JAT2A; Value: 20pF; Applications: General Purpose; Capacitance: 20pF; componentlink1description: Datasheet; componentlink1url: http://datasheets.avx.com/C0GNP0-Dielectric.pdf; componentlink2description: DigiKey Link; componentlink2url: http://digikey.com/product-detail/en/avx-corporation/06033A200JAT2A/478-11802-1-ND/8573438; Device Package: 0603 (1608 Metric); lastupdated: 2.09.2020 01:03:34; Lifecycle Status: Active; Minimum Order: 1; Mounting Type: Surface Mount, MLCC; Operating Temperature: -55°C ~ 125°C; Package / Case: 0603 (1608 Metric); packaging: TapeAndReel; partid: 3067; Part Status: Active; price: 0.04; series: -; Size / Dimension: 0.063" L x 0.032" W (1.60mm x 0.81mm); Supplier 1: DigiKey; Supplier Part Number 1: 478-11802-1-ND; Thickness (Max): 0.035" (0.90mm); Voltage - Rated: 25V
C36 C37 C43 C45 = TMK107BJ104KA-T: CAP CER 0.1UF 25V X5R 0603; manufacturer: Taiyo Yuden; Tolerance: ±10%; Part Number: TMK107BJ104KA-T; Value: 0.1 µF; Applications: SMPS Filtering; Capacitance: 0.1 µF; componentlink1description: Datasheet; componentlink1url: https://www.yuden.co.jp/productdata/catalog/mlcc01_e.pdf; componentlink2description: DigiKey Link; componentlink2url: https://www.digikey.com/en/products/detail/taiyo-yuden/TMK107BJ104KA-T/930597; Device Package: 0603 (1608 Metric); lastupdated: 18.06.2022 05:53:04; Lifecycle Status: Active; Minimum Order: 1; Mounting Type: Surface Mount, MLCC; Operating Temperature: -55°C ~ 85°C; Package / Case: 0603 (1608 Metric); packaging: TapeAndReel; partid: 9891; Part Status: Active; price: 0.01; series: M; Size / Dimension: 0.063" L x 0.031" W (1.60mm x 0.80mm); Supplier 1: DigiKey; Supplier Part Number 1: 587-1245-1-ND; Temperature Coefficient: X5R; Thickness (Max): 0.035" (0.90mm); Voltage - Rated: 25V
C46 = TMK107BJ105MAHT: CAP CER 1UF 25V X5R 0603; manufacturer: Taiyo Yuden; Tolerance: ±20%; Part Number: TMK107BJ105MAHT; Value: 1 µF; Applications: Automotive, SMPS Filtering; Capacitance: 1 µF; componentlink1description: Datasheet; componentlink1url: https://ds.yuden.co.jp/TYCOMPAS/ut/detail?pn=TMK107BJ105MAHT &u=M; componentlink2description: DigiKey Link; componentlink2url: https://www.digikey.com/en/products/detail/taiyo-yuden/TMK107BJ105MAHT/6563148; Device Package: 0603 (1608 Metric); Features: Ultra Low ESR; lastupdated: 18.06.2022 05:53:24; Lifecycle Status: Active; Minimum Order: 1; Mounting Type: Surface Mount, MLCC; Operating Temperature: -55°C ~ 85°C; Package / Case: 0603 (1608 Metric); packaging: TapeAndReel; partid: 2797; Part Status: Active; price: 0.02; Ratings: AEC-Q200; series: M; Size / Dimension: 0.063" L x 0.031" W (1.60mm x 0.80mm); Supplier 1: DigiKey; Supplier Part Number 1: 587-6356-1-ND; Temperature Coefficient: X5R; Thickness (Max): 0.035" (0.90mm); Voltage - Rated: 25V
C47 = TMK107BBJ106MA-T: CAP CER 10UF 25V X5R 0603; manufacturer: Taiyo Yuden; Tolerance: ±20%; Part Number: TMK107BBJ106MA-T; Value: 10 µF; Applications: SMPS Filtering; Capacitance: 10 µF; componentlink1description: Datasheet; componentlink1url: https://ds.yuden.co.jp/TYCOMPAS/ut/detail?pn=TMK107BBJ106MA-T &u=M; componentlink2description: DigiKey Link; componentlink2url: https://www.digikey.com/en/products/detail/taiyo-yuden/TMK107BBJ106MA-T/7403921; Device Package: 0603 (1608 Metric); lastupdated: 18.06.2022 05:53:06; Lifecycle Status: Active; Minimum Order: 1; Mounting Type: Surface Mount, MLCC; Operating Temperature: -55°C ~ 85°C; Package / Case: 0603 (1608 Metric); packaging: TapeAndReel; partid: 8967; Part Status: Active; price: 0.11; series: M; Size / Dimension: 0.063" L x 0.031" W (1.60mm x 0.80mm); Supplier 1: DigiKey; Supplier Part Number 1: 587-6023-1-ND; Temperature Coefficient: X5R; Thickness (Max): 0.039" (1.00mm); Voltage - Rated: 25V
FB1-FB5 = BBSY00100505101Y00: EMI BEAD FILETER; Manufacturer: Chilisin Electronics; Current Rating (Max): 500mA; DC Resistance (DCR) (Max): 250mOhm; Number of Lines: 1; Part Number: BBSY00100505101Y00; ComponentLink1Description: Datasheet; ComponentLink1URL: https://www.chilisin.com/upload/media/product/emi_bead/file/BBSY,BBBK_Series.pdf; ComponentLink2Description: DigiKey Link; ComponentLink2URL: http://digikey.com/product-detail/en/chilisin-electronics/BBSY00100505101Y00/2184-BBSY00100505101Y00CT-ND/10509212; Device Package: 0402 (1005 Metric); Impedance @ Frequency: 100 Ohms @ 100MHz; LastUpdated: 18.06.2022 06:33:57; Lifecycle Status: Active; Minimum Order: 1; Mounting Type: Surface Mount; Operating Temperature: -55°C ~ 125°C; Package / Case: 0402 (1005 Metric); Packaging: Unknown; PartId: 1772; Part Status: Active; Price: 0.01; Series: *; Supplier 1: DigiKey; Supplier Part Number 1: 2184-BBSY00100505101Y00CT-ND; Value: 100 Ohms @ 100MHz
R7-R10 R16-R19 = AC0603FR-0733RL: as R5 on sheet Main; Part Number: AC0603FR-0733RL; Value: 33 Ohms; ComponentLink1Description: Datasheet; ComponentLink1URL: https://www.yageo.com/upload/media/product/productsearch/datasheet/rchip/PYu-AC_51_RoHS_L_7.pdf; ComponentLink2Description: DigiKey Link; ComponentLink2URL: https://www.digikey.com/en/products/detail/yageo/AC0603FR-0733RL/5896043; Composition: Thick Film; Device Package: 0603 (1608 Metric); Features: Automotive AEC-Q200, Moisture Resistant; Height - Seated (Max): 0.022" (0.55mm); LastUpdated: 18.06.2022 06:13:30; Lifecycle Status: Active; Minimum Order: 1; Number of Terminations: 2; Operating Temperature: -55°C ~ 155°C; Package / Case: 0603 (1608 Metric); Packaging: CutTape; PartId: 17381; Part Status: Active; Price: 0.01; Ratings: AEC-Q200; Resistance: 33 Ohms; Series: AC; Size / Dimension: 0.063" L x 0.031" W (1.60mm x 0.80mm); Supplier 1: DigiKey; Supplier Part Number 1: YAG3599CT-ND; Supplier Device Package: 0603; Tolerance: ±1%
R11 R13-R15 R20 R21 = 5110: RES SMD 0 OHM JUMPER 1/2W 0603; Part Number: 5110; Manufacturer: Keystone Electronics; Power (Watts): 0.5W, 1/2W; Value: 0 Ohms; ComponentLink1Description: Datasheet; ComponentLink1URL: http://keyelco.com/userAssets/file/M65p54.pdf; ComponentLink2Description: DigiKey Link; ComponentLink2URL: https://www.digikey.com/en/products/detail/keystone-electronics/5110/5118870; Composition: Metal Element; Device Package: 0603 (1608 Metric); Height - Seated (Max): 0.028" (0.70mm); LastUpdated: 18.06.2022 06:13:19; Lifecycle Status: Active; Minimum Order: 1; Number of Terminations: 2; Package / Case: 0603 (1608 Metric); Packaging: TapeAndReel; PartId: 20779; Part Status: Active; Price: 0.16; Resistance: 0 Ohms; Series: -; Size / Dimension: 0.061" L x 0.033" W (1.55mm x 0.85mm); Supplier 1: DigiKey; Supplier Part Number 1: 36-5110CT-ND; Supplier Device Package: 0603; Tolerance: Jumper
R12 = AC0603JR-0710KL: RES SMD 10K OHM 5% 1/10W 0603; Manufacturer: Yageo; Power (Watts): 0.1W, 1/10W; Temperature Coefficient: ±100ppm/°C; Part Number: AC0603JR-0710KL; Value: 10 kOhms; ComponentLink1Description: Datasheet; ComponentLink1URL: https://www.yageo.com/upload/media/product/productsearch/datasheet/rchip/PYu-AC_51_RoHS_L_7.pdf; ComponentLink2Description: DigiKey Link; ComponentLink2URL: https://www.digikey.com/en/products/detail/yageo/AC0603JR-0710KL/2827830; Composition: Thick Film; Device Package: 0603 (1608 Metric); Features: Automotive AEC-Q200, Moisture Resistant; Height - Seated (Max): 0.022" (0.55mm); LastUpdated: 18.06.2022 06:13:45; Lifecycle Status: Active; Minimum Order: 1; Number of Terminations: 2; Operating Temperature: -55°C ~ 155°C; Package / Case: 0603 (1608 Metric); Packaging: CutTape; PartId: 12247; Part Status: Active; Price: 0.01; Ratings: AEC-Q200; Resistance: 10 kOhms; Series: AC; Size / Dimension: 0.063" L x 0.031" W (1.60mm x 0.80mm); Supplier 1: DigiKey; Supplier Part Number 1: 311-10KLECT-ND; Supplier Device Package: 0603; Tolerance: ±5%
U2 = OPT3006YMFR: No Description Available; Mfr_Name: Texas Instruments; Type: DEV; RefDes: RefDes; Copyright: Copyright (C) 2022 Ultra Librarian. All rights reserved.; Manufacturer_Part_Number: OPT3006YMFR; Digi-Key_Part_Number_1: 296-45132-1-ND; Digi-Key_Part_Number_2: 296-45132-2-ND; Digi-Key_Part_Number_3: 296-45132-6-ND
U3 = ICM-20948: Accelerometer, Gyroscope, Magnetometer, 9 Axis Sensor I²C, SPI Output; Manufacturer: TDK InvenSense; Accel Range: 2/4/8/16g; Accel Resolution: 16bits; Accel Sensitivity: 2048/4096/8192/16384LSB/g; Gyro Range: 250/500/1000/2000°/s; Gyro Sensitivity: 16.4/32.8/65.5/131LSB/°/s; Mag Sense Range: 4900uT; Mag Sensitivity: 0.15uT/LSB; Max Supply Voltage: 3.6V; Min Supply Voltage: 1.71V; Operating Supply Current: 8-3110uA; Sensor Output: I2C,SPI; Standoff Height: 0mm; Symbol Hash: f55aed9b0ea5cc58222276bed1303401ef86fe4f7dd241f5d042c171e1ba1323; Verification Version: 0.0.0.3; Datasheet Path: datasheets/IC_TDK_InvenSense_ICM-20948_eec.pdf; Ambient Temperature Range High: +85°C; Ambient Temperature Range Low: -40°C; Automotive: No; ComponentLink1Description: Upverter; ComponentLink1URL: https://upverter.com/part/id/133434ff2df35346/; ComponentLink2Description: Datasheet; ComponentLink2URL: https://invensense.tdk.com/wp-content/uploads/2016/06/DS-000189-ICM-20948-v1.3.pdf?ref_disty=digikey; Digikey Description: IMU ACCEL/GYRO/COMPI2C/SPI 24QFN; Digikey Part Number: 1428-1123-1-ND; Height: 1.05mm; Ipc Land Pattern Name: QFN40P300X300X100-24; Lead Free: Yes; Mouser Part Number: 410-ICM-20948; Package: 0; Part Number: ICM-20948; Resolution: 16bits; RoHS: TRUE; Sensor Type: Accelerometer,Gyroscope,Magnetometer; Supplier 1: Digi-Key; Supplier 2: Mouser; Supplier Part Number 1: 1428-1123-1-ND; Supplier Part Number 2: 410-ICM-20948; Temperature: -40°C to +85°C; Temperature Range High: +85°C; Temperature Range Low: -40°C; helpURL: https://upverter.com/part/id/133434ff2df35346/
U4 = TXB0104RGYR: 4-Bit Bidirectional Voltage-Level Shifter with Auto Direction Sensing and +/-15 kV ESD Protect 14-VQFN -40 to 85; Package: None; Price: None; Value: *; MP: TXB0104RGYR; Availability: Unavailable
U5 = BME280: DIGITAL HUMIDITY, PRESSURE AND TEMPERATURE SENSOR<br>* Digital interface IÂ²C (up to 3.4 MHz) and SPI (3 and 4 wire, up to 10 MHz)* Supply voltage VDD main supply voltage range: 1.71 V to 3.6 V*VDDIO interface voltage range: 1.2 V to 3.6 V<br> Operating range -40â€¦+85 Â°C, 0â€¦100 % rel. humidity, 300â€¦1100 hPa <br><br>  The library has been designed by<a href="https://www.facebook.com/groups/eaglecadsoftUK"> Richard Magdycz</a>; Price: None; MP: BME280; Value: *; Availability: Unavailable; Package: None
U6 = IAM-20381: Accelerometer X, Y, Z Axis Â±2g, 4g, 8g, 16g 16-LGA (3x3); MF: TDK InvenSense; Package: PQFN-16 TDK-InvenSense; Availability: Bad; SnapEDA_Link: https://www.snapeda.com/parts/IAM-20381/TDK%20InvenSense/view-part/2757131/?ref=snap; MP: IAM-20381; Price: None; Value: *; Check_prices: https://www.snapeda.com/parts/IAM-20381/TDK%20InvenSense/view-part/2757131/?ref=eda